# Altium project Power_Merge_Board.PrjPCB
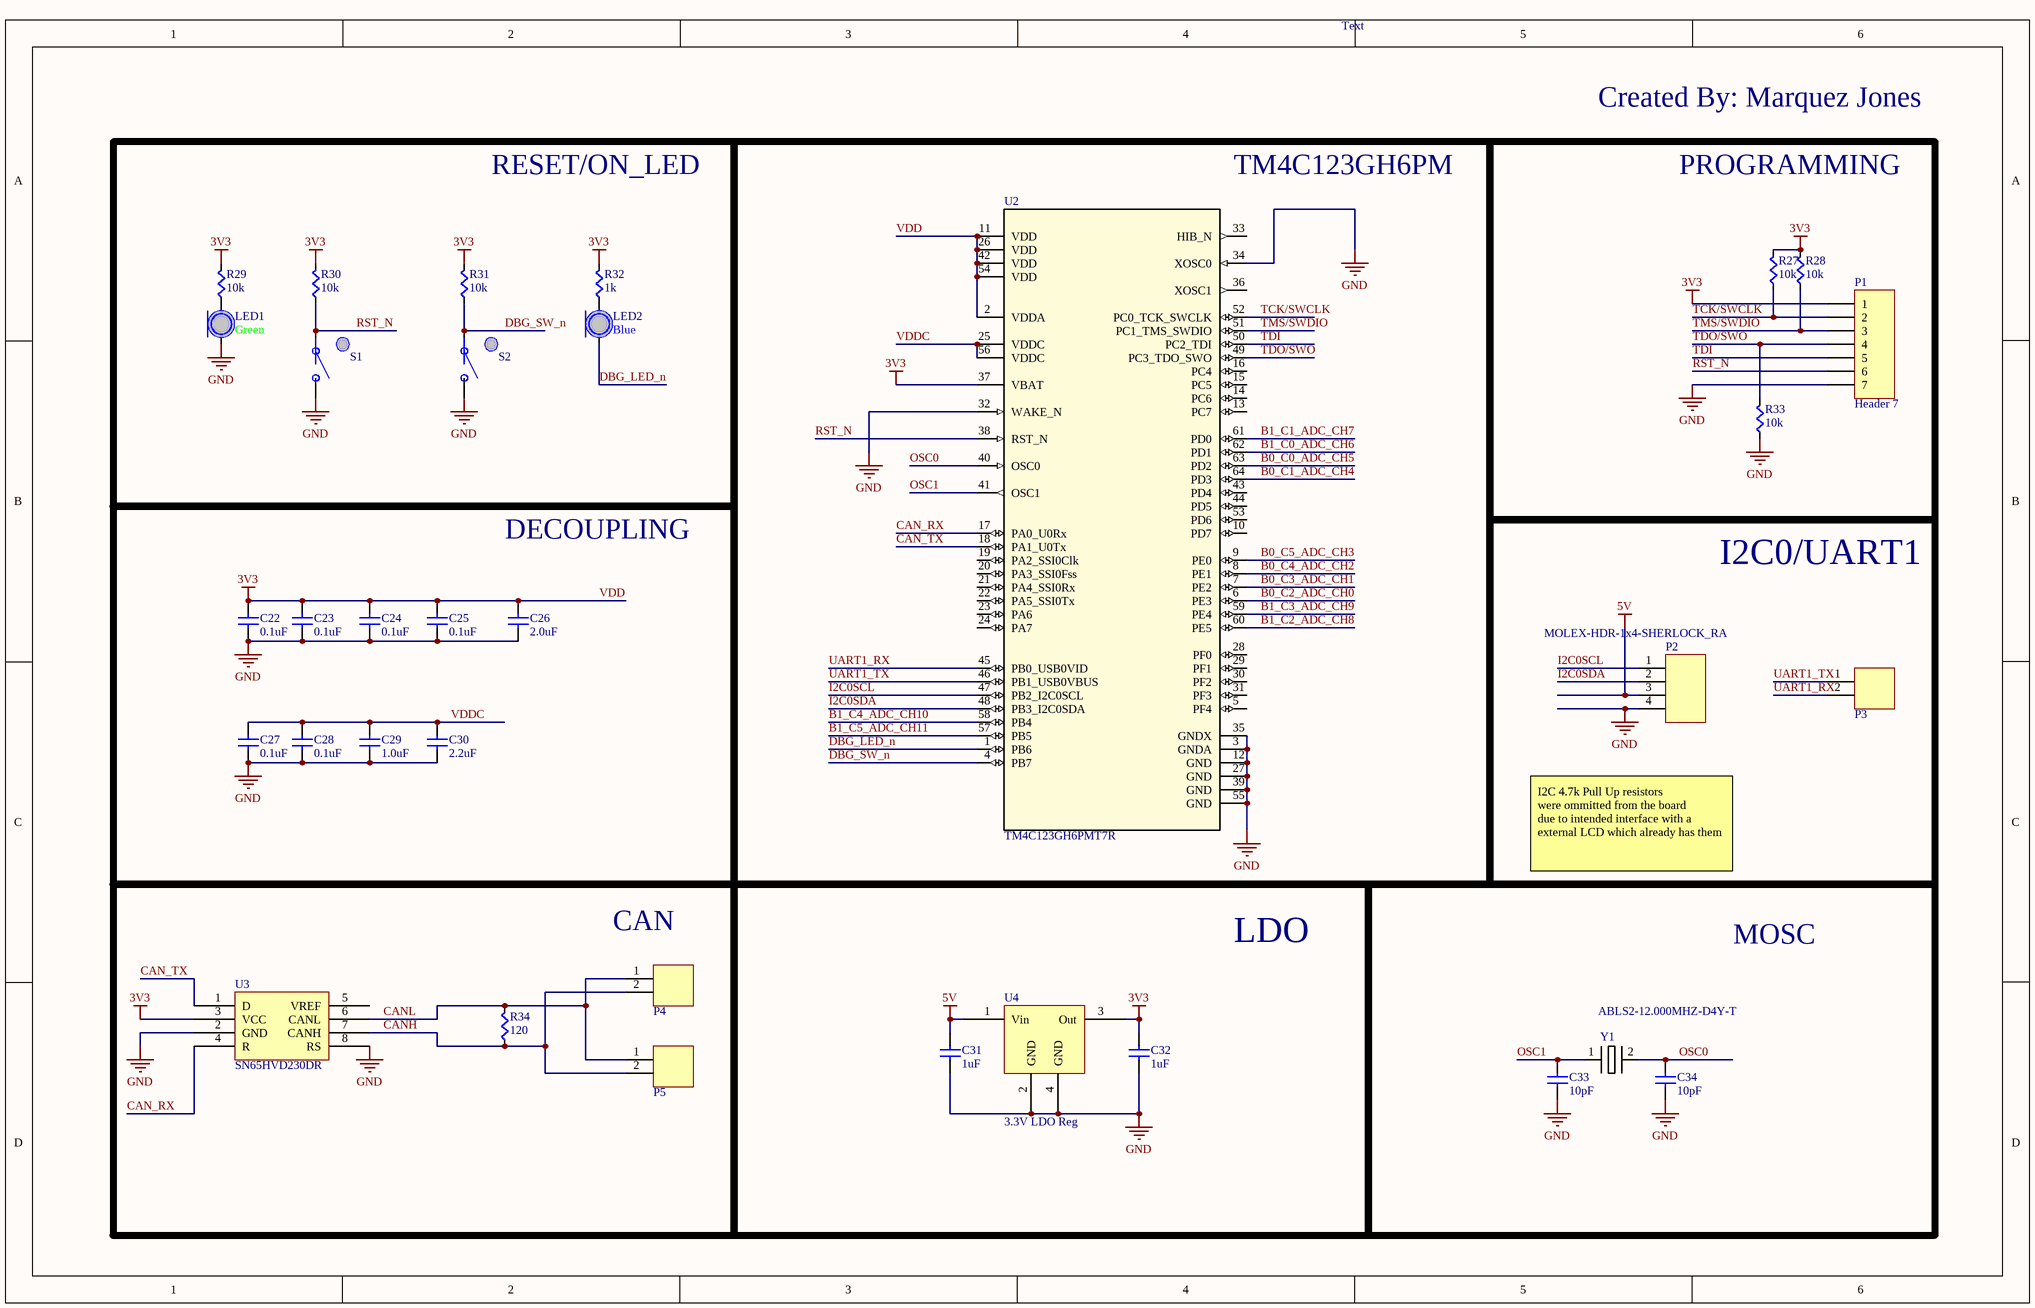
[diagram p0: Tiva_C_Base.SchDoc]
2 sheets, 83 parts. Net scope: global (net labels, ports and power ports of the same name join across sheets).
Board file: Power_Merge_Board.PcbDoc
Sheets:
  Tiva_C_Base.SchDoc
  Batt_Op_Amp.SchDoc

## Sheet Tiva_C_Base.SchDoc
size B

### Parts
C22  value 0.1uF  [CAPC0603]  (hidden comment: Cap)
C23  value 0.1uF  [CAPC0603]  (hidden comment: Cap)
C24  value 0.1uF  [CAPC0603]  (hidden comment: Cap)
C25  value 0.1uF  [CAPC0603]  (hidden comment: Cap)
C26  value 2.0uF  [CAPC0603]  (hidden comment: Cap)
C27  value 0.1uF  [CAPC0603]  (hidden comment: Cap)
C28  value 0.1uF  [CAPC0603]  (hidden comment: Cap)
C29  value 1.0uF  [CAPC0603]  (hidden comment: Cap)
C30  value 2.2uF  [CAPC0603]  (hidden comment: Cap)
C31  value 1uF  [CAPC0603]  (hidden comment: Cap)
C32  value 1uF  [CAPC0603]  (hidden comment: Cap)
C33  value 10pF  [CAPC0603]  (hidden comment: Cap)
C34  value 10pF  [CAPC0603]  (hidden comment: Cap)
LED1  Color: Green  [LED0603]  (hidden comment: LED)
LED2  Color: Blue  [LED0603]  (hidden comment: LED)
P1  Header 7  [HDR1X7]
P2  MOLEX-HDR-1x4-SHERLOCK_RA  [MOLEX-HDR-1X4-SHERLOCK-RA]
P3  2-pin Horz Sherlock  [MOLEX-HDR-1X2-SHERLOCK-HORZ]  (value not drawn)
P4  2-pin Horz Sherlock  [MOLEX-HDR-1X2-SHERLOCK-HORZ]  (value not drawn)
P5  2-pin Horz Sherlock  [MOLEX-HDR-1X2-SHERLOCK-HORZ]  (value not drawn)
R27  value 10k  [RES0603]  (hidden comment: Res)
R28  value 10k  [RES0603]  (hidden comment: Res)
R29  value 10k  [RES0603]  (hidden comment: Res)
R30  value 10k  [RES0603]  (hidden comment: Res)
R31  value 10k  [RES0603]  (hidden comment: Res)
R32  value 1k  [RES0603]  (hidden comment: Res)
R33  value 10k  [RES0603]  (hidden comment: Res)
R34  value 120  [RES0603]  (hidden comment: Res)
S1  Button  [PTS645xxxxSMTR92]  (value not drawn)
S2  Button  [PTS645xxxxSMTR92]  (value not drawn)
U2  TM4C123GH6PMT7R  [PM0064A_N]
U3  SN65HVD230DR  [SOIC-8pin]
U4  3.3V LDO Reg  [SOT23-4n]
Y1  ABLS2-12.000MHZ-D4Y-T  [HC49/US]

### Blocks framed on the sheet
RESET/ON_LED: LED1 LED2 R29-R32 S1 S2
TM4C123GH6PM: U2
PROGRAMMING: P1 R27 R28 R33
DECOUPLING: C22-C30
I2C0/UART1: P2 P3
CAN: P4 P5 R34 U3
LDO: C31 C32 U4
MOSC: C33 C34 Y1

### Nets
5V: C31.1(A) P2.3 U4.1(Vin)
GND: C22.2(B) C23.2(B) C24.2(B) C25.2(B) C26.2(B) C27.2(B) C28.2(B) C29.2(B) C30.2(B) C31.2(B) C32.2(B) C33.2(B) C34.2(B) LED1.C P1.7 P2.4 R33.2(B) S1.B S2.B U2.3(GNDA) U2.12(GND) U2.27(GND) U2.32(WAKE_N) U2.34(XOSC0) U2.35(GNDX) U2.39(GND) U2.55(GND) U3.2(GND) U3.8(RS) U4.2(GND) U4.4(GND)
VDD: C22.1(A) C23.1(A) C24.1(A) C25.1(A) C26.1(A) C32.1(A) P1.1 R27.1(A) R28.1(A) R29.1(A) R30.1(A) R31.1(A) R32.1(A) U2.2(VDDA) U2.11(VDD) U2.26(VDD) U2.37(VBAT) U2.42(VDD) U2.54(VDD) U3.3(VCC) U4.3(Out)  [also labelled 3V3]
B0_C0_ADC_CH5: U2.63(PD2)
B0_C1_ADC_CH4: U2.64(PD3)
B0_C2_ADC_CH0: U2.6(PE3)
B0_C3_ADC_CH1: U2.7(PE2)
B0_C4_ADC_CH2: U2.8(PE1)
B0_C5_ADC_CH3: U2.9(PE0)
B1_C0_ADC_CH6: U2.62(PD1)
B1_C1_ADC_CH7: U2.61(PD0)
B1_C2_ADC_CH8: U2.60(PE5)
B1_C3_ADC_CH9: U2.59(PE4)
B1_C4_ADC_CH10: U2.58(PB4)
B1_C5_ADC_CH11: U2.57(PB5)
CAN_RX: U2.17(PA0_U0Rx) U3.4(R)
CAN_TX: U2.18(PA1_U0Tx) U3.1(D)
CANH: P4.2 P5.2 R34.2(B) U3.7(CANH)
CANL: P4.1 P5.1 R34.1(A) U3.6(CANL)
DBG_LED_n: LED2.C U2.1(PB6)
DBG_SW_n: R31.2(B) S2.A U2.4(PB7)
I2C0SCL: P2.1 U2.47(PB2_I2C0SCL)
I2C0SDA: P2.2 U2.48(PB3_I2C0SDA)
OSC0: C34.1(A) U2.40(OSC0) Y1.2
OSC1: C33.1(A) U2.41(OSC1) Y1.1
RST_N: P1.6 R30.2(B) S1.A U2.38(RST_N)
TCK/SWCLK: P1.2 R27.2(B) U2.52(PC0_TCK_SWCLK)
TDI: P1.5 U2.50(PC2_TDI)
TDO/SWO: P1.4 R33.1(A) U2.49(PC3_TDO_SWO)
TMS/SWDIO: P1.3 R28.2(B) U2.51(PC1_TMS_SWDIO)
UART1_RX: P3.2 U2.45(PB0_USB0VID)
UART1_TX: P3.1 U2.46(PB1_USB0VBUS)
VDDC: C27.1(A) C28.1(A) C29.1(A) C30.1(A) U2.25(VDDC) U2.56(VDDC)
NetLED1_A: LED1.A R29.2(B)
NetLED2_A: LED2.A R32.2(B)

Not connected (* = marked no-connect by the designer): U2 5(PF4) 10(PD7) 13(PC7) 14(PC6) 15(PC5) 16(PC4) 19(PA2_SSI0Clk) 20(PA3_SSI0Fss) 21(PA4_SSI0Rx) 22(PA5_SSI0Tx) 23(PA6) 24(PA7) 28(PF0) 29(PF1) 30(PF2) 31(PF3) 33(HIB_N) 36(XOSC1) 43(PD4) 44(PD5) 53(PD6); U3 5(VREF)

### Notes on the sheet
- Text
- Created By: Marquez Jones
- I2C 4.7k Pull Up resistors
  were ommitted from the board
  due to intended interface with a
  external LCD which already has them

### Library data of the parts
C31 C32 = Cap: Manufacturer Part Number: C0603C105K8PACTU; Supplier 1: Digi-Key; Supplier Part Number 1: 399-3118-1-ND
P1 = Header 7: Header, 7-Pin; LatestRevisionDate: 17-Jul-2002; LatestRevisionNote: Re-released for DXP Platform.; Publisher: Altium Limited
P2 = MOLEX-HDR-1x4-SHERLOCK_RA: Header, Molex, 2mm Pitch Sherlock Header, Single Row, Horizontal, 4 Circuits, Length 3.3mm; Manufacturer Part Number: 0353630460; Supplier Part Number 1: WM18933-ND; Manufacturer: Molex; Supplier 1: Digikey
P3-P5 = MOLEX-HDR-1x2-SHERLOCK_RA: Header, Molex, 2mm Pitch Sherlock Header, Single Row, Horizontal, 2 Circuits, Length 3.3mm,  0353630260; Manufacturer: Molex Inc; Manufacturer Part Number: 0353630260; Supplier Part Number 1: WM18931-ND; Supplier 1: Digi-Key
S1 S2 = Button: SPST Button; Supplier 1: Digi-Key; Supplier Part Number 1: CKN9087CT-ND
U2 = TM4C123GH6PMT7R: Imported; PartNumber: TM4C123GH6PMTR; Manufacturer: Texas Instruments; CompType: IC; PIN_COUNT: 64; Application_BuildNumber: *; Alternate_PartNumber: TM4C123GH6PMT; PackageReference: PM0064A; MountType: SMT; RoHS: Y; RefDes: RefDes; TYPE: TYPE; Value: Value
U3 = SN65HVD230DR: IC TXRX CAN 1MBPS 3.3V 8SOIC; Supplier 1: Digi-Key; Supplier Part Numbe 1: 296-11654-1-ND
U4 = LM3940IMPX-3.3: IC REG LDO 3.3V 1A SOT223; Supplier 1: Digi-Key; Supplier Part Number 1: LM3940IMPX-3.3/NOPBCT-ND
Y1 = ABLS2-12.000MHZ-D4Y-T: 12MHz ±30ppm Crystal 18pF 50 Ohm -40°C ~ 85°C Surface Mount HC49/US; Supplier 1: Digi-Key; Supplier Part Number 1: 535-9869-1-ND
C22-C30 C33 C34 = Cap: Supplier 1: Digi-Key; Supplier Part Number 1: 1276-1000-1-ND
LED1 LED2 = LED: Supplier 1: Digi-Key; Supplier Part Number 1: 754-1122-1-ND
R27-R34 = Res: Supplier 1: Digi-Key; Supplier Part Number 1: RMCF0603JT10K0CT-ND

## Sheet Batt_Op_Amp.SchDoc
size C
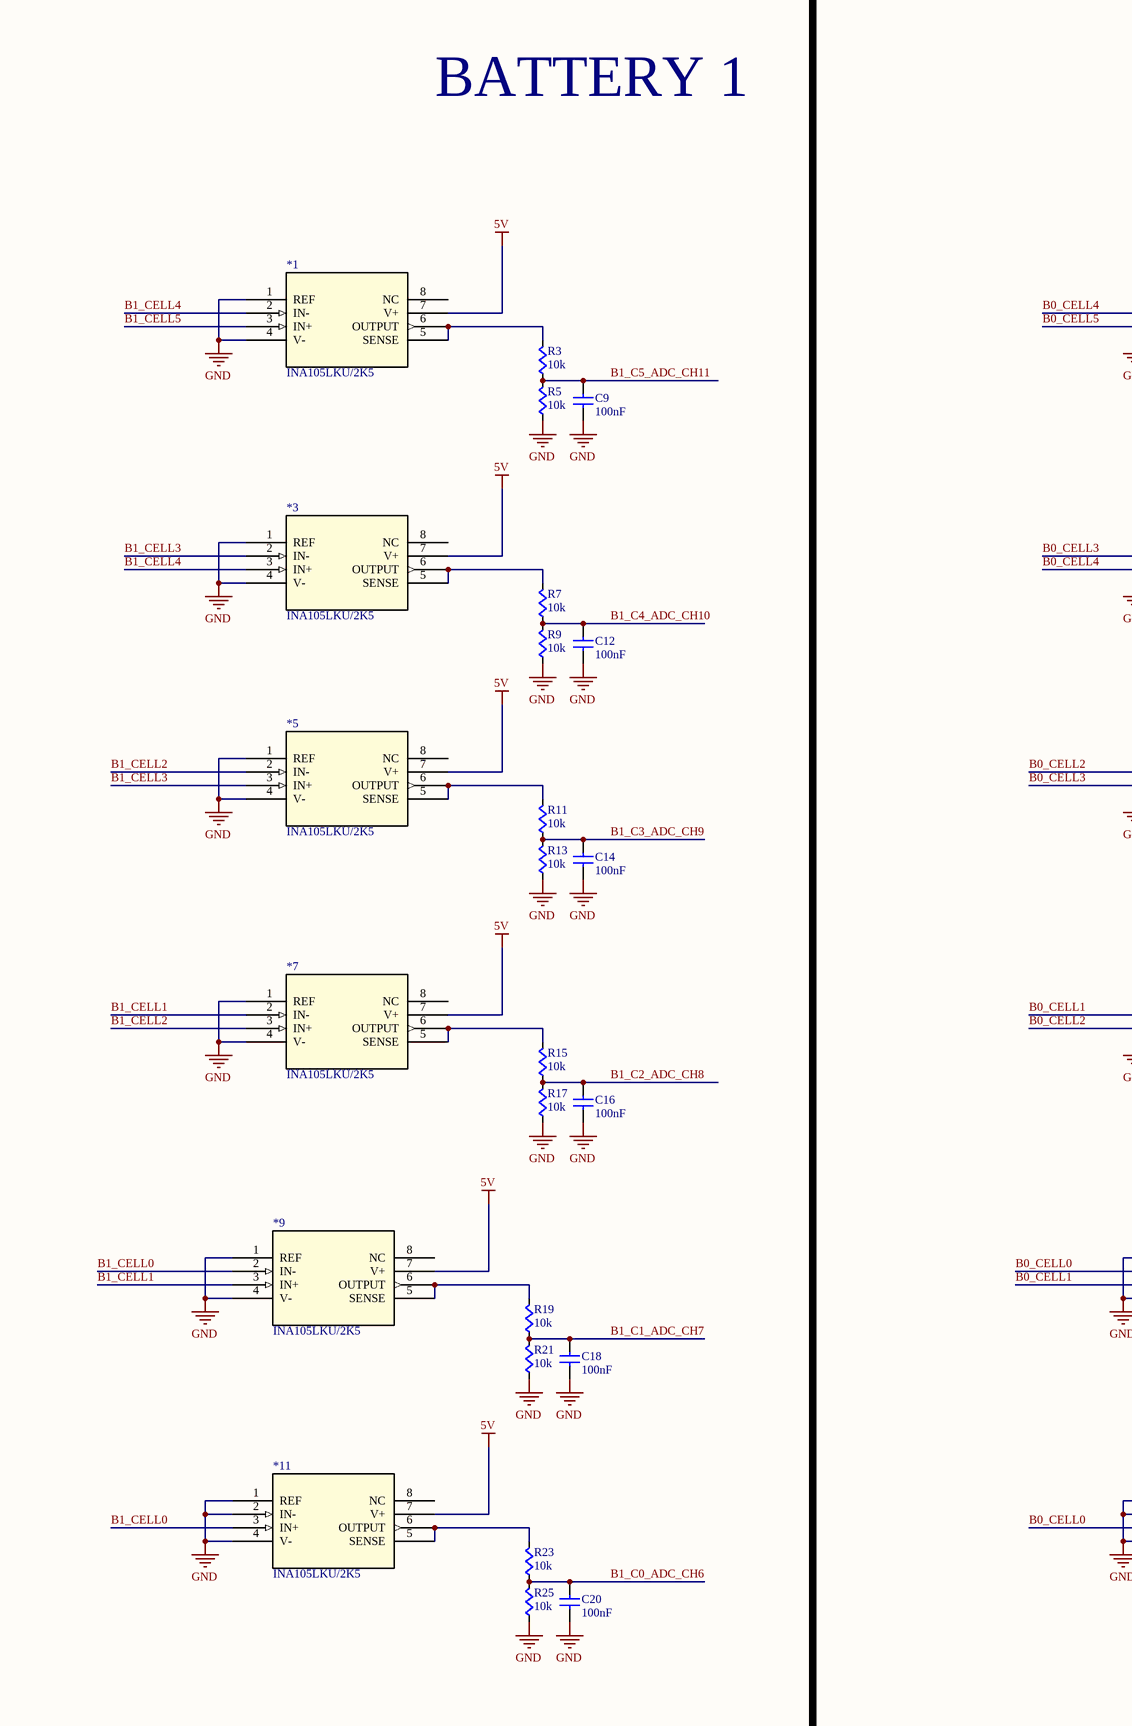
[diagram p1: Batt_Op_Amp.SchDoc, left]
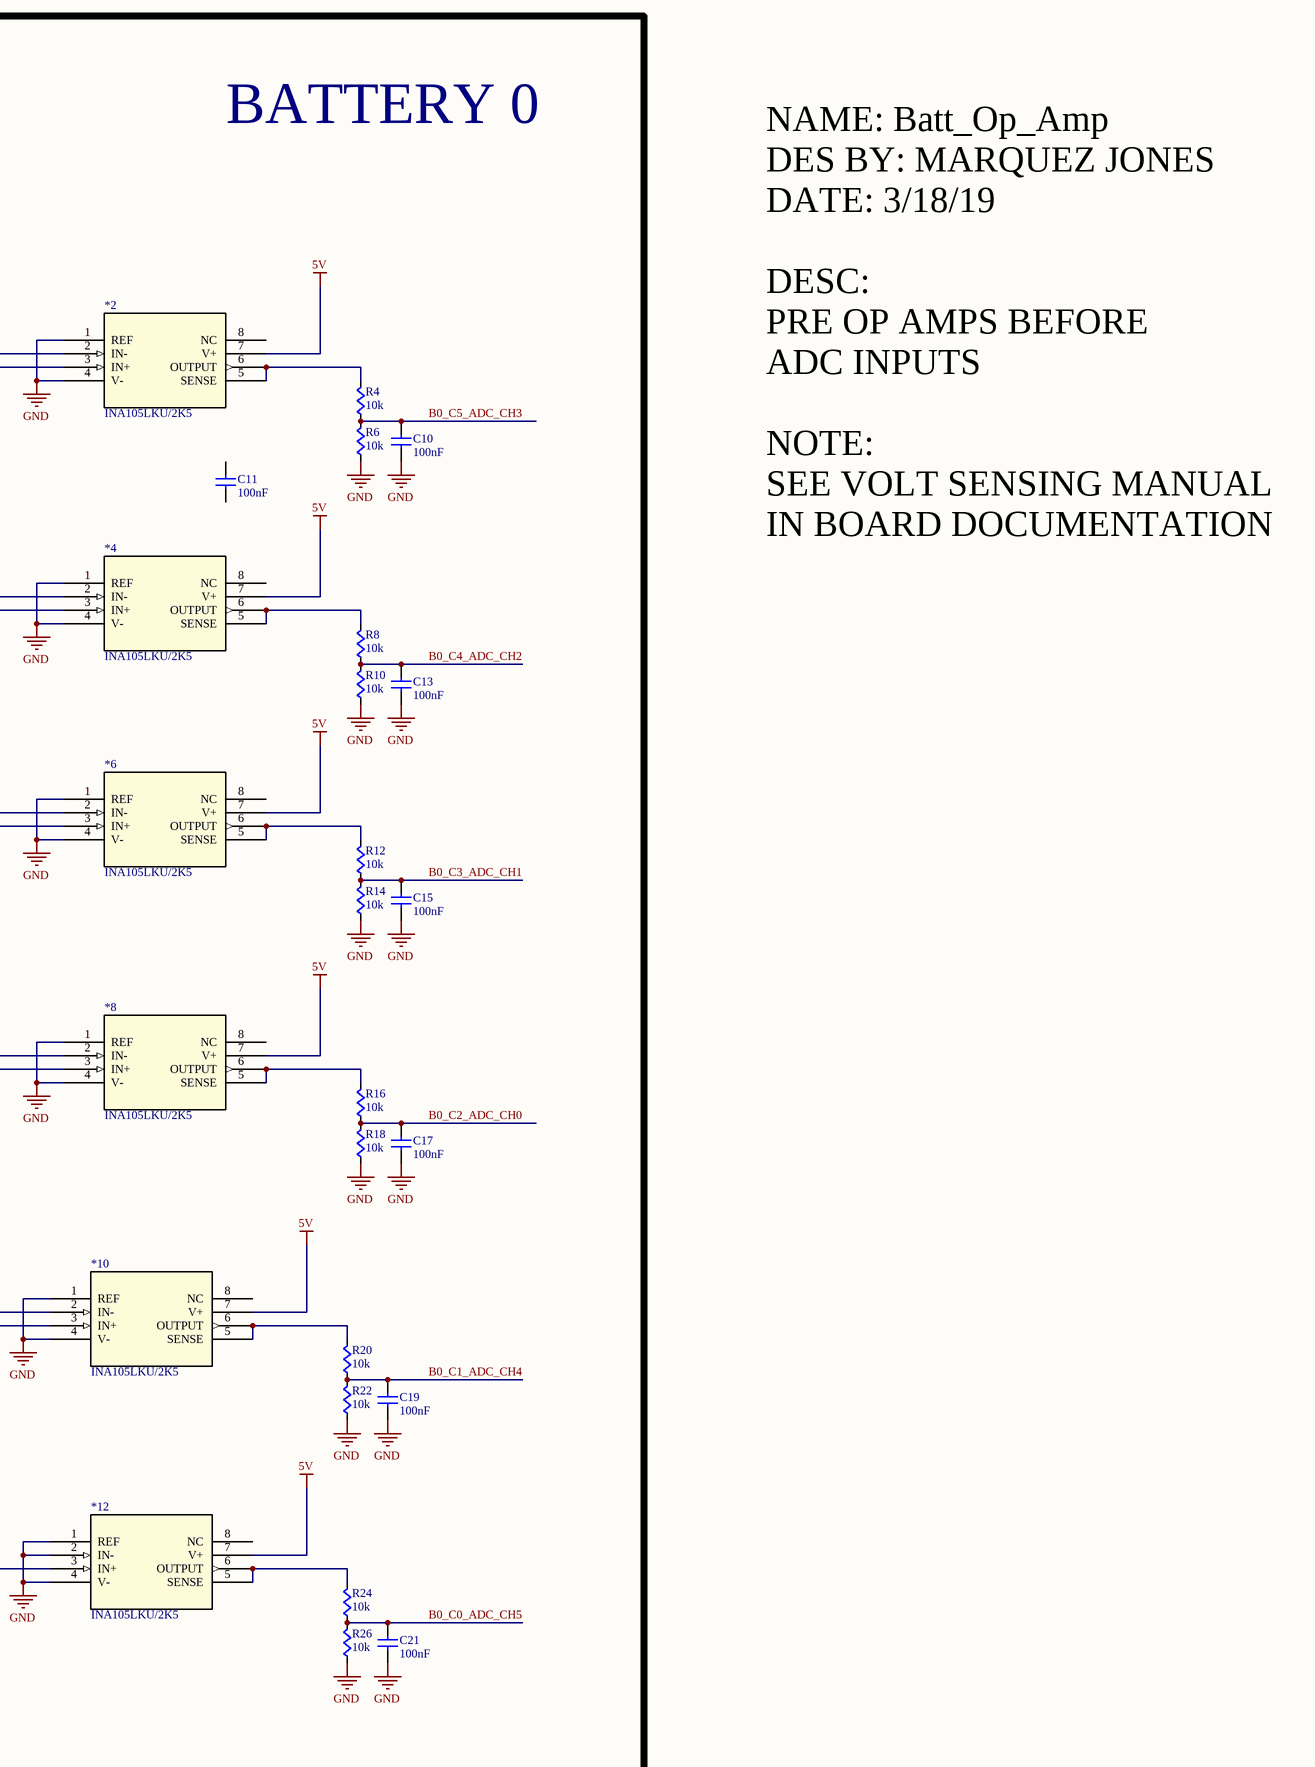
[diagram p2: Batt_Op_Amp.SchDoc, right]

### Parts
*1  INA105LKU/2K5  [SOIC-8N]
*2  INA105LKU/2K5  [SOIC-8N]
*3  INA105LKU/2K5  [SOIC-8N]
*4  INA105LKU/2K5  [SOIC-8N]
*5  INA105LKU/2K5  [SOIC-8N]
*6  INA105LKU/2K5  [SOIC-8N]
*7  INA105LKU/2K5  [SOIC-8N]
*8  INA105LKU/2K5  [SOIC-8N]
*9  INA105LKU/2K5  [SOIC-8N]
*10  INA105LKU/2K5  [SOIC-8N]
*11  INA105LKU/2K5  [SOIC-8N]
*12  INA105LKU/2K5  [SOIC-8N]
C9  value 100nF  [CAPC0603]  (hidden comment: Cap)
C10  value 100nF  [CAPC0603]  (hidden comment: Cap)
C11  value 100nF  [CAPC0603]  (hidden comment: Cap)
C12  value 100nF  [CAPC0603]  (hidden comment: Cap)
C13  value 100nF  [CAPC0603]  (hidden comment: Cap)
C14  value 100nF  [CAPC0603]  (hidden comment: Cap)
C15  value 100nF  [CAPC0603]  (hidden comment: Cap)
C16  value 100nF  [CAPC0603]  (hidden comment: Cap)
C17  value 100nF  [CAPC0603]  (hidden comment: Cap)
C18  value 100nF  [CAPC0603]  (hidden comment: Cap)
C19  value 100nF  [CAPC0603]  (hidden comment: Cap)
C20  value 100nF  [CAPC0603]  (hidden comment: Cap)
C21  value 100nF  [CAPC0603]  (hidden comment: Cap)
R3  value 10k  [WSLP5931]  (hidden comment: Res)
R4  value 10k  [WSLP5931]  (hidden comment: Res)
R5  value 10k  [WSLP5931]  (hidden comment: Res)
R6  value 10k  [WSLP5931]  (hidden comment: Res)
R7  value 10k  [WSLP5931]  (hidden comment: Res)
R8  value 10k  [WSLP5931]  (hidden comment: Res)
R9  value 10k  [WSLP5931]  (hidden comment: Res)
R10  value 10k  [WSLP5931]  (hidden comment: Res)
R11  value 10k  [WSLP5931]  (hidden comment: Res)
R12  value 10k  [WSLP5931]  (hidden comment: Res)
R13  value 10k  [WSLP5931]  (hidden comment: Res)
R14  value 10k  [WSLP5931]  (hidden comment: Res)
R15  value 10k  [WSLP5931]  (hidden comment: Res)
R16  value 10k  [WSLP5931]  (hidden comment: Res)
R17  value 10k  [WSLP5931]  (hidden comment: Res)
R18  value 10k  [WSLP5931]  (hidden comment: Res)
R19  value 10k  [WSLP5931]  (hidden comment: Res)
R20  value 10k  [WSLP5931]  (hidden comment: Res)
R21  value 10k  [WSLP5931]  (hidden comment: Res)
R22  value 10k  [WSLP5931]  (hidden comment: Res)
R23  value 10k  [WSLP5931]  (hidden comment: Res)
R24  value 10k  [WSLP5931]  (hidden comment: Res)
R25  value 10k  [WSLP5931]  (hidden comment: Res)
R26  value 10k  [WSLP5931]  (hidden comment: Res)

### Blocks framed on the sheet
BATTERY 1: *1 *3 *5 *7 *9 *11 C9 C12 C14 C16 C18 C20 R3 R5 R7 R9 R11 R13 R15 R17 R19 R21 R23 R25
BATTERY 0: *2 *4 *6 *8 *10 *12 C10 C11 C13 C15 C17 C19 C21 R4 R6 R8 R10 R12 R14 R16 R18 R20 R22 R24 R26

### Nets
5V: *1.7(V+) *2.7(V+) *3.7(V+) *4.7(V+) *5.7(V+) *6.7(V+) *7.7(V+) *8.7(V+) *9.7(V+) *10.7(V+) *11.7(V+) *12.7(V+)
GND: *1.1(REF) *1.4(V-) *2.1(REF) *2.4(V-) *3.1(REF) *3.4(V-) *4.1(REF) *4.4(V-) *5.1(REF) *5.4(V-) *6.1(REF) *6.4(V-) *7.1(REF) *7.4(V-) *8.1(REF) *8.4(V-) *9.1(REF) *9.4(V-) *10.1(REF) *10.4(V-) *11.1(REF) *11.2(IN-) *11.4(V-) *12.1(REF) *12.2(IN-) *12.4(V-) C9.2(B) C10.2(B) C12.2(B) C13.2(B) C14.2(B) C15.2(B) C16.2(B) C17.2(B) C18.2(B) C19.2(B) C20.2(B) C21.2(B) R5.2(B) R6.2(B) R9.2(B) R10.2(B) R13.2(B) R14.2(B) R17.2(B) R18.2(B) R21.2(B) R22.2(B) R25.2(B) R26.2(B)
B0_C0_ADC_CH5: C21.1(A) R24.2(B) R26.1(A)
B0_C1_ADC_CH4: C19.1(A) R20.2(B) R22.1(A)
B0_C2_ADC_CH0: C17.1(A) R16.2(B) R18.1(A)
B0_C3_ADC_CH1: C15.1(A) R12.2(B) R14.1(A)
B0_C4_ADC_CH2: C13.1(A) R8.2(B) R10.1(A)
B0_C5_ADC_CH3: C10.1(A) R4.2(B) R6.1(A)
B0_CELL0: *10.2(IN-) *12.3(IN+)
B0_CELL1: *8.2(IN-) *10.3(IN+)
B0_CELL2: *6.2(IN-) *8.3(IN+)
B0_CELL3: *4.2(IN-) *6.3(IN+)
B0_CELL4: *2.2(IN-) *4.3(IN+)
B0_CELL5: *2.3(IN+)
B1_C0_ADC_CH6: C20.1(A) R23.2(B) R25.1(A)
B1_C1_ADC_CH7: C18.1(A) R19.2(B) R21.1(A)
B1_C2_ADC_CH8: C16.1(A) R15.2(B) R17.1(A)
B1_C3_ADC_CH9: C14.1(A) R11.2(B) R13.1(A)
B1_C4_ADC_CH10: C12.1(A) R7.2(B) R9.1(A)
B1_C5_ADC_CH11: C9.1(A) R3.2(B) R5.1(A)
B1_CELL0: *9.2(IN-) *11.3(IN+)
B1_CELL1: *7.2(IN-) *9.3(IN+)
B1_CELL2: *5.2(IN-) *7.3(IN+)
B1_CELL3: *3.2(IN-) *5.3(IN+)
B1_CELL4: *1.2(IN-) *3.3(IN+)
B1_CELL5: *1.3(IN+)
Net*1_5: *1.5(SENSE) *1.6(OUTPUT) R3.1(A)
Net*2_5: *2.5(SENSE) *2.6(OUTPUT) R4.1(A)
Net*3_5: *3.5(SENSE) *3.6(OUTPUT) R7.1(A)
Net*4_5: *4.5(SENSE) *4.6(OUTPUT) R8.1(A)
Net*5_5: *5.5(SENSE) *5.6(OUTPUT) R11.1(A)
Net*6_5: *6.5(SENSE) *6.6(OUTPUT) R12.1(A)
Net*7_5: *7.5(SENSE) *7.6(OUTPUT) R15.1(A)
Net*8_5: *8.5(SENSE) *8.6(OUTPUT) R16.1(A)
Net*9_5: *9.5(SENSE) *9.6(OUTPUT) R19.1(A)
Net*10_5: *10.5(SENSE) *10.6(OUTPUT) R20.1(A)
Net*11_5: *11.5(SENSE) *11.6(OUTPUT) R23.1(A)
Net*12_5: *12.5(SENSE) *12.6(OUTPUT) R24.1(A)

Not connected (* = marked no-connect by the designer): *1 8(NC); *2 8(NC); *3 8(NC); *4 8(NC); *5 8(NC); *6 8(NC); *7 8(NC); *8 8(NC); *9 8(NC); *10 8(NC); *11 8(NC); *12 8(NC); C11 1(A) 2(B)

### Notes on the sheet
- NAME: Batt_Op_Amp
  DES BY: MARQUEZ JONES
  DATE: 3/18/19
  DESC:
  PRE OP AMPS BEFORE
  ADC INPUTS
  NOTE:
  SEE VOLT SENSING MANUAL
  IN BOARD DOCUMENTATION

### Library data of the parts
C9-C21 = Cap: Supplier 1: Digi-Key; Supplier Part Number 1: 1276-1000-1-ND
R3-R26 = Res: Supplier 1: Digi-Key; Supplier Part Number 1: RMCF0603JT10K0CT-ND

## Nets that join several sheets
5V: Tiva_C_Base (C31.1 P2.3 U4.1), Batt_Op_Amp (12 pins)
GND: Tiva_C_Base (31 pins), Batt_Op_Amp (50 pins)
B0_C0_ADC_CH5: Tiva_C_Base (U2.63), Batt_Op_Amp (C21.1 R24.2 R26.1)
B0_C1_ADC_CH4: Tiva_C_Base (U2.64), Batt_Op_Amp (C19.1 R20.2 R22.1)
B0_C2_ADC_CH0: Tiva_C_Base (U2.6), Batt_Op_Amp (C17.1 R16.2 R18.1)
B0_C3_ADC_CH1: Tiva_C_Base (U2.7), Batt_Op_Amp (C15.1 R12.2 R14.1)
B0_C4_ADC_CH2: Tiva_C_Base (U2.8), Batt_Op_Amp (C13.1 R8.2 R10.1)
B0_C5_ADC_CH3: Tiva_C_Base (U2.9), Batt_Op_Amp (C10.1 R4.2 R6.1)
B1_C0_ADC_CH6: Tiva_C_Base (U2.62), Batt_Op_Amp (C20.1 R23.2 R25.1)
B1_C1_ADC_CH7: Tiva_C_Base (U2.61), Batt_Op_Amp (C18.1 R19.2 R21.1)
B1_C2_ADC_CH8: Tiva_C_Base (U2.60), Batt_Op_Amp (C16.1 R15.2 R17.1)
B1_C3_ADC_CH9: Tiva_C_Base (U2.59), Batt_Op_Amp (C14.1 R11.2 R13.1)
B1_C4_ADC_CH10: Tiva_C_Base (U2.58), Batt_Op_Amp (C12.1 R7.2 R9.1)
B1_C5_ADC_CH11: Tiva_C_Base (U2.57), Batt_Op_Amp (C9.1 R3.2 R5.1)